# EAGLE schematic prot-pic24-mtouch+tft (EAGLE 6.2)
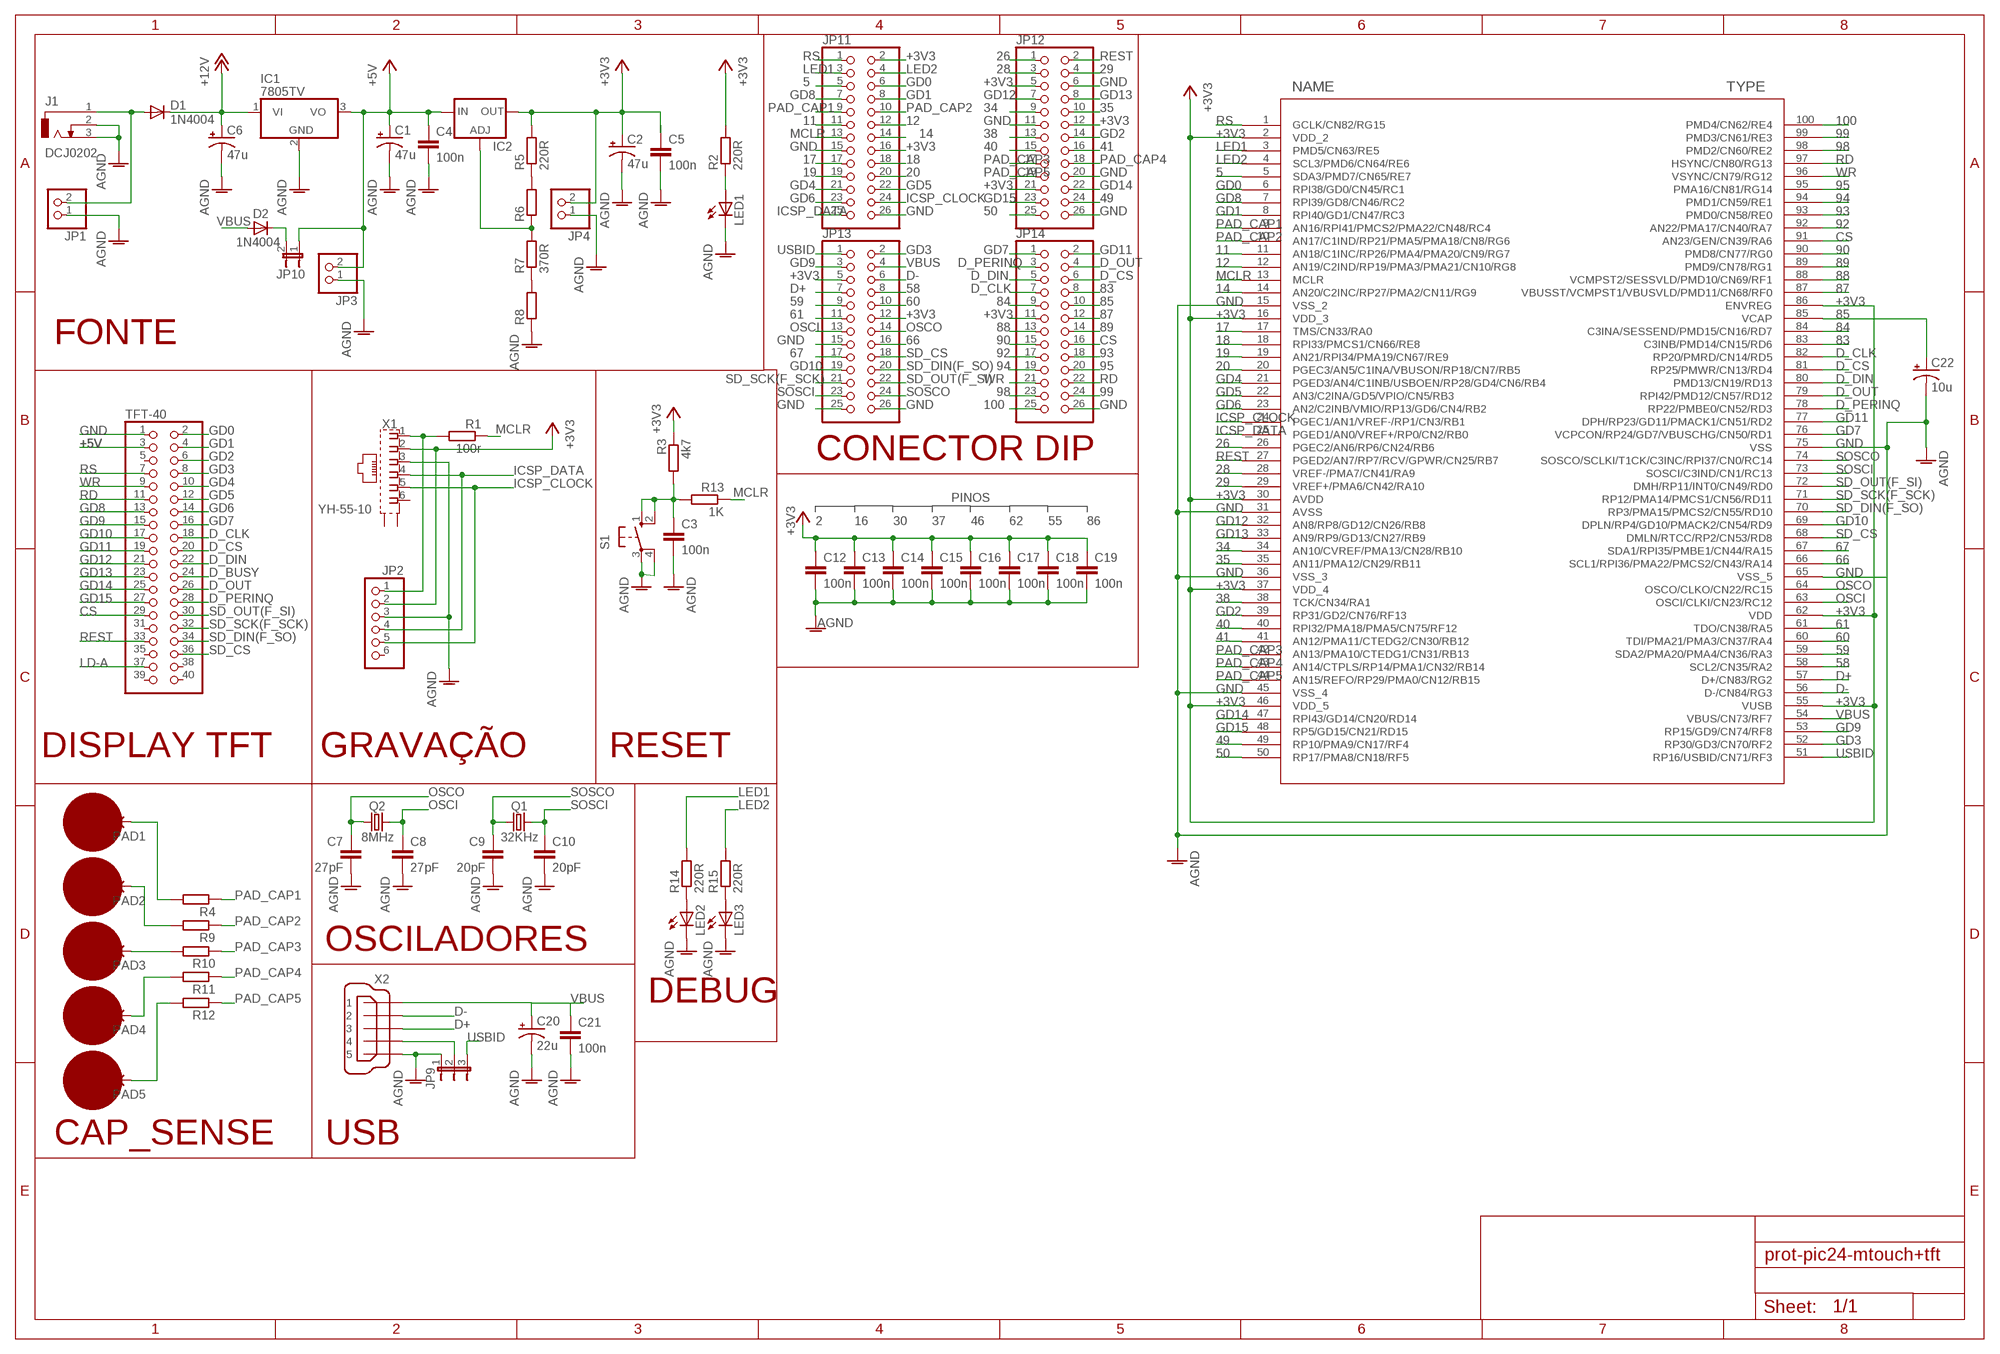
[diagram p0: schematic, sheet 1]

## Parts
C1  47u  CPOL-USE2.5-5  [E2,5-5]
C2  47u  CPOL-USE2.5-5  [E2,5-5]
C3  100n  C-EU050-025X075  [C050-025X075]
C4  100n  C-EU050-025X075  [C050-025X075]
C5  100n  C-EU050-025X075  [C050-025X075]
C6  47u  CPOL-USE2.5-5  [E2,5-5]
C7  27pF  C-EU025-030X050  [C025-030X050]
C8  27pF  C-EU025-030X050  [C025-030X050]
C9  20pF  C-EU025-030X050  [C025-030X050]
C10  20pF  C-EU025-030X050  [C025-030X050]
C12  100n  C-EU025-025X050  [C025-025X050]
C13  100n  C-EU025-030X050  [C025-030X050]
C14  100n  C-EU025-030X050  [C025-030X050]
C15  100n  C-EU025-030X050  [C025-030X050]
C16  100n  C-EU025-030X050  [C025-030X050]
C17  100n  C-EU025-030X050  [C025-030X050]
C18  100n  C-EU025-030X050  [C025-030X050]
C19  100n  C-EU025-030X050  [C025-030X050]
C20  22u  CPOL-USE2.5-5  [E2,5-5]
C21  100n  C-EU025-030X050  [C025-030X050]
C22  10u  CPOL-USE2.5-5  [E2,5-5]
D1  1N4004  [DO41-10]
D2  1N4004  [DO41-10]
IC1  7805TV  [TO220V]
IC2  LM317TS  [317TS]
J1  DCJ0202  [DCJ0202]
JP1  PINHD-1X2  [1X02]
JP2  PINHD-1X6  [1X06]
JP3  PINHD-1X2  [1X02]
JP4  PINHD-1X2  [1X02]
JP9  JP2E  [JP2]
JP10  JP1E  [JP1]
JP11  PINHD-2X13  [2X13]
JP12  PINHD-2X13  [2X13]
JP13  PINHD-2X13  [2X13]
JP14  PINHD-2X13  [2X13]
LED1  LED3MM  [LED3MM]
LED2  LED3MM  [LED3MM]
LED3  LED3MM  [LED3MM]
PAD1  SMD5  [SMD2,54-5,08]
PAD2  SMD5  [SMD2,54-5,08]
PAD3  SMD5  [SMD2,54-5,08]
PAD4  SMD5  [SMD2,54-5,08]
PAD5  SMD5  [SMD2,54-5,08]
Q1  32KHz  CRYSTALTC26V  [TC26V]
Q2  8MHz  CRYSTALHC49S  [HC49/S]
R1  100r  R-EU_0204/2V  [0204V]
R2  220R  R-EU_0204/2V  [0204V]
R3  4k7  R-EU_0204/2V  [0204V]
R4  220R  R-EU_0204/2V  [0204V]
R5  220R  R-EU_0204/2V  [0204V]
R6  R-EU_0204/2V  [0204V]
R7  370R  R-EU_0204/2V  [0204V]
R8  R-EU_0204/2V  [0204V]
R9  220R  R-EU_0204/2V  [0204V]
R10  220R  R-EU_0204/2V  [0204V]
R11  220R  R-EU_0204/2V  [0204V]
R12  220R  R-EU_0204/2V  [0204V]
R13  1K  R-EU_0204/2V  [0204V]
R14  220R  R-EU_0204/2V  [0204V]
R15  220R  R-EU_0204/2V  [0204V]
S1  10-XX  [B3F-10XX]
TFT-40  PINHD-2X20  [2X20]
U$1  PIC24FJXXXDAX10_  [TQFP100_12X12MC]
X1  YH-55-10  [YH-55-10]
X2  MINI-USB-32005-301  [32005-301]

## Nets
5: JP11.5 U$1.5(SDA3/PMD7/CN65/RE7)
11: JP11.11 U$1.11(AN18/C1INC/RP26/PMA4/PMA20/CN9/RG7)
12: JP11.12 U$1.12(AN19/C2IND/RP19/PMA3/PMA21/CN10/RG8)
14: JP11.14 U$1.14(AN20/C2INC/RP27/PMA2/CN11/RG9)
17: JP11.17 U$1.17(TMS/CN33/RA0)
18: JP11.18 U$1.18(RPI33/PMCS1/CN66/RE8)
19: JP11.19 U$1.19(AN21/RPI34/PMA19/CN67/RE9)
20: JP11.20 U$1.20(PGEC3/AN5/C1INA/VBUSON/RP18/CN7/RB5)
26: JP12.1 U$1.26(PGEC2/AN6/RP6/CN24/RB6)
28: JP12.3 U$1.28(VREF-/PMA7/CN41/RA9)
29: JP12.4 U$1.29(VREF+/PMA6/CN42/RA10)
34: JP12.9 U$1.34(AN10/CVREF/PMA13/CN28/RB10)
35: JP12.10 U$1.35(AN11/PMA12/CN29/RB11)
38: JP12.13 U$1.38(TCK/CN34/RA1)
40: JP12.15 U$1.40(RPI32/PMA18/PMA5/CN75/RF12)
41: JP12.16 U$1.41(AN12/PMA11/CTEDG2/CN30/RB12)
49: JP12.24 U$1.49(RP10/PMA9/CN17/RF4)
50: JP12.25 U$1.50(RP17/PMA8/CN18/RF5)
58: JP13.8 U$1.58(SCL2/CN35/RA2)
59: JP13.9 U$1.59(SDA2/PMA20/PMA4/CN36/RA3)
60: JP13.10 U$1.60(TDI/PMA21/PMA3/CN37/RA4)
61: JP13.11 U$1.61(TDO/CN38/RA5)
66: JP13.16 U$1.66(SCL1/RPI36/PMA22/PMCS2/CN43/RA14)
67: JP13.17 U$1.67(SDA1/RPI35/PMBE1/CN44/RA15)
83: JP14.8 U$1.83(C3INB/PMD14/CN15/RD6)
84: JP14.9 U$1.84(C3INA/SESSEND/PMD15/CN16/RD7)
85: C22.+ JP14.10 U$1.85(VCAP)
87: JP14.12 U$1.87(VBUSST/VCMPST1/VBUSVLD/PMD11/CN68/RF0)
88: JP14.13 U$1.88(VCMPST2/SESSVLD/PMD10/CN69/RF1)
89: JP14.14 U$1.89(PMD9/CN78/RG1)
90: JP14.15 U$1.90(PMD8/CN77/RG0)
92: JP14.17 U$1.92(AN22/PMA17/CN40/RA7)
93: JP14.18 U$1.93(PMD0/CN58/RE0)
94: JP14.19 U$1.94(PMD1/CN59/RE1)
95: JP14.20 U$1.95(PMA16/CN81/RG14)
98: JP14.23 U$1.98(PMD2/CN60/RE2)
99: JP14.24 U$1.99(PMD3/CN61/RE3)
100: JP14.25 U$1.100(PMD4/CN62/RE4)
+3V3: C2.+ C5.1 C12.1 C13.1 C14.1 C15.1 C16.1 C17.1 C18.1 C19.1 IC2.2(OUT) JP2.2 JP4.2 JP11.2 JP11.16 JP12.5 JP12.12 JP12.21 JP13.5 JP13.12 JP14.11 R2.2 R3.1 R5.2 U$1.2(VDD_2) U$1.16(VDD_3) U$1.30(AVDD) U$1.37(VDD_4) U$1.46(VDD_5) U$1.55(VUSB) U$1.62(VDD) U$1.86(ENVREG) X1.2
+5V: C1.+ C4.1 IC1.3(VO) IC2.3(IN) JP3.2 JP10.1 TFT-40.3
+12V: C6.+ D1.C IC1.1(VI)
AGND: LED2.K(C) LED3.K(C)
CS: JP14.16 TFT-40.29 U$1.91(AN23/GEN/CN39/RA6)
D+: JP13.7 U$1.57(D+/CN83/RG2) X2.3
D-: JP13.6 U$1.56(D-/CN84/RG3) X2.2
D_BUSY: TFT-40.24
D_CLK: JP14.7 TFT-40.18 U$1.82(RP20/PMRD/CN14/RD5)
D_CS: JP14.6 TFT-40.20 U$1.81(RP25/PMWR/CN13/RD4)
D_DIN: JP14.5 TFT-40.22 U$1.80(PMD13/CN19/RD13)
D_OUT: JP14.4 TFT-40.26 U$1.79(RPI42/PMD12/CN57/RD12)
D_PERINQ: JP14.3 TFT-40.28 U$1.78(RP22/PMBE0/CN52/RD3)
GD0: JP11.6 TFT-40.2 U$1.6(RPI38/GD0/CN45/RC1)
GD1: JP11.8 TFT-40.4 U$1.8(RPI40/GD1/CN47/RC3)
GD2: JP12.14 TFT-40.6 U$1.39(RP31/GD2/CN76/RF13)
GD3: JP13.2 TFT-40.8 U$1.52(RP30/GD3/CN70/RF2)
GD4: JP11.21 TFT-40.10 U$1.21(PGED3/AN4/C1INB/USBOEN/RP28/GD4/CN6/RB4)
GD5: JP11.22 TFT-40.12 U$1.22(AN3/C2INA/GD5/VPIO/CN5/RB3)
GD6: JP11.23 TFT-40.14 U$1.23(AN2/C2INB/VMIO/RP13/GD6/CN4/RB2)
GD7: JP14.1 TFT-40.16 U$1.76(VCPCON/RP24/GD7/VBUSCHG/CN50/RD1)
GD8: JP11.7 TFT-40.13 U$1.7(RPI39/GD8/CN46/RC2)
GD9: JP13.3 TFT-40.15 U$1.53(RP15/GD9/CN74/RF8)
GD10: JP13.19 TFT-40.17 U$1.69(DPLN/RP4/GD10/PMACK2/CN54/RD9)
GD11: JP14.2 TFT-40.19 U$1.77(DPH/RP23/GD11/PMACK1/CN51/RD2)
GD12: JP12.7 TFT-40.21 U$1.32(AN8/RP8/GD12/CN26/RB8)
GD13: JP12.8 TFT-40.23 U$1.33(AN9/RP9/GD13/CN27/RB9)
GD14: JP12.22 TFT-40.25 U$1.47(RPI43/GD14/CN20/RD14)
GD15: JP12.23 TFT-40.27 U$1.48(RP5/GD15/CN21/RD15)
GND: C1.- C2.- C3.2 C4.2 C5.2 C6.- C7.2 C8.2 C9.2 C10.2 C12.2 C13.2 C14.2 C15.2 C16.2 C17.2 C18.2 C19.2 C20.- C21.2 C22.- IC1.2(GND) J1.2 J1.3 JP1.1 JP2.3 JP3.1 JP4.1 JP9.1 JP11.15 JP11.26 JP12.6 JP12.11 JP12.20 JP12.26 JP13.15 JP13.25 JP13.26 JP14.26 LED1.K(C) R8.1 S1.3(P) S1.4(P1) TFT-40.1 U$1.15(VSS_2) U$1.31(AVSS) U$1.36(VSS_3) U$1.45(VSS_4) U$1.65(VSS_5) U$1.75(VSS) X1.3 X2.5 ; supply symbol labelled AGND
ICSP_CLOCK: JP2.5 JP11.24 U$1.24(PGEC1/AN1/VREF-/RP1/CN3/RB1) X1.5
ICSP_DATA: JP2.4 JP11.25 U$1.25(PGED1/AN0/VREF+/RP0/CN2/RB0) X1.4
LD-A: TFT-40.37
LED1: JP11.3 R14.2 U$1.3(PMD5/CN63/RE5)
LED2: JP11.4 R15.2 U$1.4(SCL3/PMD6/CN64/RE6)
MCLR: JP11.13 R1.1 R13.1 U$1.13(MCLR)
N$1: D1.A J1.1 JP1.2
N$2: LED1.A R2.1
N$3: JP2.1 R1.2 X1.1
N$4: R5.1 R6.2
N$5: IC2.1(ADJ) R6.1 R7.2
N$6: R7.1 R8.2
N$7: PAD1.1(P) R4.2
N$8: JP9.2 X2.4
N$9: PAD2.1(P) R9.2
N$10: PAD3.1(P) R10.2
N$11: PAD4.1(P) R11.2
N$12: PAD5.1(P) R12.2
N$13: C3.1 R3.2 R13.2 S1.1(S) S1.2(S1)
N$14: LED2.A R14.1
N$15: D2.C JP10.2
N$16: LED3.A R15.1
OSCI: C8.1 JP13.13 Q2.2 U$1.63(OSCI/CLKI/CN23/RC12)
OSCO: C7.1 JP13.14 Q2.1 U$1.64(OSCO/CLKO/CN22/RC15)
PAD_CAP1: JP11.9 R4.1 U$1.9(AN16/RPI41/PMCS2/PMA22/CN48/RC4)
PAD_CAP2: JP11.10 R9.1 U$1.10(AN17/C1IND/RP21/PMA5/PMA18/CN8/RG6)
PAD_CAP3: JP12.17 R10.1 U$1.42(AN13/PMA10/CTEDG1/CN31/RB13)
PAD_CAP4: JP12.18 R11.1 U$1.43(AN14/CTPLS/RP14/PMA1/CN32/RB14)
PAD_CAP5: JP12.19 R12.1 U$1.44(AN15/REFO/RP29/PMA0/CN12/RB15)
RD: JP14.22 TFT-40.11 U$1.97(HSYNC/CN80/RG13)
REST: JP12.2 TFT-40.33 U$1.27(PGED2/AN7/RP7/RCV/GPWR/CN25/RB7)
RS: JP11.1 TFT-40.7 U$1.1(GCLK/CN82/RG15)
SD_CS: JP13.18 TFT-40.36 U$1.68(DMLN/RTCC/RP2/CN53/RD8)
SD_DIN(F_SO): JP13.20 TFT-40.34 U$1.70(RP3/PMA15/PMCS2/CN55/RD10)
SD_OUT(F_SI): JP13.22 TFT-40.30 U$1.72(DMH/RP11/INT0/CN49/RD0)
SD_SCK(F_SCK): JP13.21 TFT-40.32 U$1.71(RP12/PMA14/PMCS1/CN56/RD11)
SOSCI: C10.1 JP13.23 Q1.2 U$1.73(SOSCI/C3IND/CN1/RC13)
SOSCO: C9.1 JP13.24 Q1.1 U$1.74(SOSCO/SCLKI/T1CK/C3INC/RPI37/CN0/RC14)
USBID: JP9.3 JP13.1 U$1.51(RP16/USBID/CN71/RF3)
VBUS: C20.+ C21.1 D2.A JP13.4 U$1.54(VBUS/CN73/RF7) X2.1
WR: JP14.21 TFT-40.9 U$1.96(VSYNC/CN79/RG12)
Unconnected: JP2.6 TFT-40.5 TFT-40.31 TFT-40.35 TFT-40.38 TFT-40.39 TFT-40.40 X1.6 X1.S1(S) X1.S2(S)

## Notes on the sheet
- FONTE
- CONECTOR DIP
- PINOS
- 2 | 16 | 30 | 37 | 46 | 62 | 55 | 86
- DISPLAY TFT | GRAVAÇÃO | RESET
- OSCILADORES
- DEBUG
- CAP_SENSE | USB

## Library data of the parts
C1 C2 C6 C20 C22 = rcl:CPOL-US: POLARIZED CAPACITOR, American symbol
C3-C5 C7-C10 C12-C19 C21 = rcl:C-EU: CAPACITOR, European symbol
D1 D2 = diode:1N4004: DIODE general purpose rectifier, 1 A
IC1 = linear:78*: Positive VOLTAGE REGULATOR Source: http://cache.national.com/ds/LM/LM78L05.pdf http://www.fairchildsemi.com/ds/LM/LM7805.pdf
IC2 = v-reg:LM317TS: VOLTAGE REGULATOR
J1 = con-jack:DCJ0202: DC POWER JACK Source: DCJ0202.pdf; OC_FARNELL: unknown; OC_NEWARK: unknown
JP1 JP3 JP4 = pinhead:PINHD-1X2: PIN HEADER
JP2 = pinhead:PINHD-1X6: PIN HEADER
JP9 = jumper:JP2E: JUMPER
JP10 = jumper:JP1E: JUMPER
JP11-JP14 = pinhead:PINHD-2X13: PIN HEADER
LED1-LED3 = led:LED: LED OSRAM: - CHIPLED LG R971, LG N971, LY N971, LG Q971, LY Q971, LO R971, LY R971 LH N974, LH R974 LS Q976, LO Q976, LY Q976 LO Q996 - Hyper CHIPLED LW Q18S LB Q993, LB Q99A, LB R99A - SideLED LS A670, LO A670, LY A670, LG A670, LP A670 LB A673, LV A673, LT A673, LW A673 LH A674 LY A675 LS A676, LA A676, LO A676, LY A676, LW A676 LS A679, LY A679, LG A679 - Hyper Micro SIDELED® LS Y876, LA Y876, LO Y876, LY Y876 LT Y87S - SmartLED LW L88C, LW L88S LB L89C, LB L89S, LG L890 LS L89K, LO L89K, LY L89K LS L896, LA L896, LO L896, LY L896 - TOPLED LS T670, LO T670, LY T670, LG T670, LP T670 LSG T670, LSP T670, LSY T670, LOP T670, LYG T670 LG T671, LOG T671, LSG T671 LB T673, LV T673, LT T673, LW T673 LH T674 LS T676, LA T676, LO T676, LY T676, LB T676, LH T676, LSB T676, LW T676 LB T67C, LV T67C, LT T67C, LS T67K, LO T67K, LY T67K, LW E67C LS E67B, LA E67B, LO E67B, LY E67B, LB E67C, LV E67C, LT E67C LW T67C LS T679, LY T679, LG T679 LS T770, LO T770, LY T770, LG T770, LP T770 LB T773, LV T773, LT T773, LW T773 LH T774 LS E675, LA E675, LY E675, LS T675 LS T776, LA T776, LO T776, LY T776, LB T776 LHGB T686 LT T68C, LB T68C - Hyper Mini TOPLED® LB M676 - Mini TOPLED Santana® LG M470 LS M47K, LO M47K, LY M47K Source: http://www.osram.convergy.de LUXEON: - LUMILED® LXK2-PW12-R00, LXK2-PW12-S00, LXK2-PW14-U00, LXK2-PW14-V00 LXK2-PM12-R00, LXK2-PM12-S00, LXK2-PM14-U00 LXK2-PE12-Q00, LXK2-PE12-R00, LXK2-PE12-S00, LXK2-PE14-T00, LXK2-PE14-U00 LXK2-PB12-K00, LXK2-PB12-L00, LXK2-PB12-M00, LXK2-PB14-N00, LXK2-PB14-P00, LXK2-PB14-Q00 LXK2-PR12-L00, LXK2-PR12-M00, LXK2-PR14-Q00, LXK2-PR14-R00 LXK2-PD12-Q00, LXK2-PD12-R00, LXK2-PD12-S00 LXK2-PH12-R00, LXK2-PH12-S00 LXK2-PL12-P00, LXK2-PL12-Q00, LXK2-PL12-R00 Source: www.luxeon.com KINGBRIGHT: KA-3528ASYC Source: www.kingbright.com
PAD1-PAD5 = wirepad:SMD5: SMD PAD
Q1 = crystal:CRYSTAL: CRYSTAL; OC_FARNELL: unknown; OC_NEWARK: unknown
Q2 = crystal:CRYSTAL: CRYSTAL; OC_FARNELL: 1667008; OC_NEWARK: unknown
R1-R15 = rcl:R-EU_: RESISTOR, European symbol
S1 = switch-omron:10-XX: OMRON SWITCH; MPN: B3F-1000; OC_FARNELL: 176432; OC_NEWARK: 36M3542
TFT-40 = pinhead:PINHD-2X20: PIN HEADER
U$1 = PIC24FJ256TESTE:PIC24FJXXXDAX10_
X1 = con-wenzhou-yihua:YH-55-10: RJ11 6 connects Source: YH-55-10.pdf; OC_FARNELL: unknown; OC_NEWARK: unknown
X2 = con-cypressindustries:MINI-USB-: MINI USB-B Conector Source: www.cypressindustries.com; OC_FARNELL: unknown; OC_NEWARK: unknown